# EAGLE design box-din4-lcd (EAGLE 5.11)
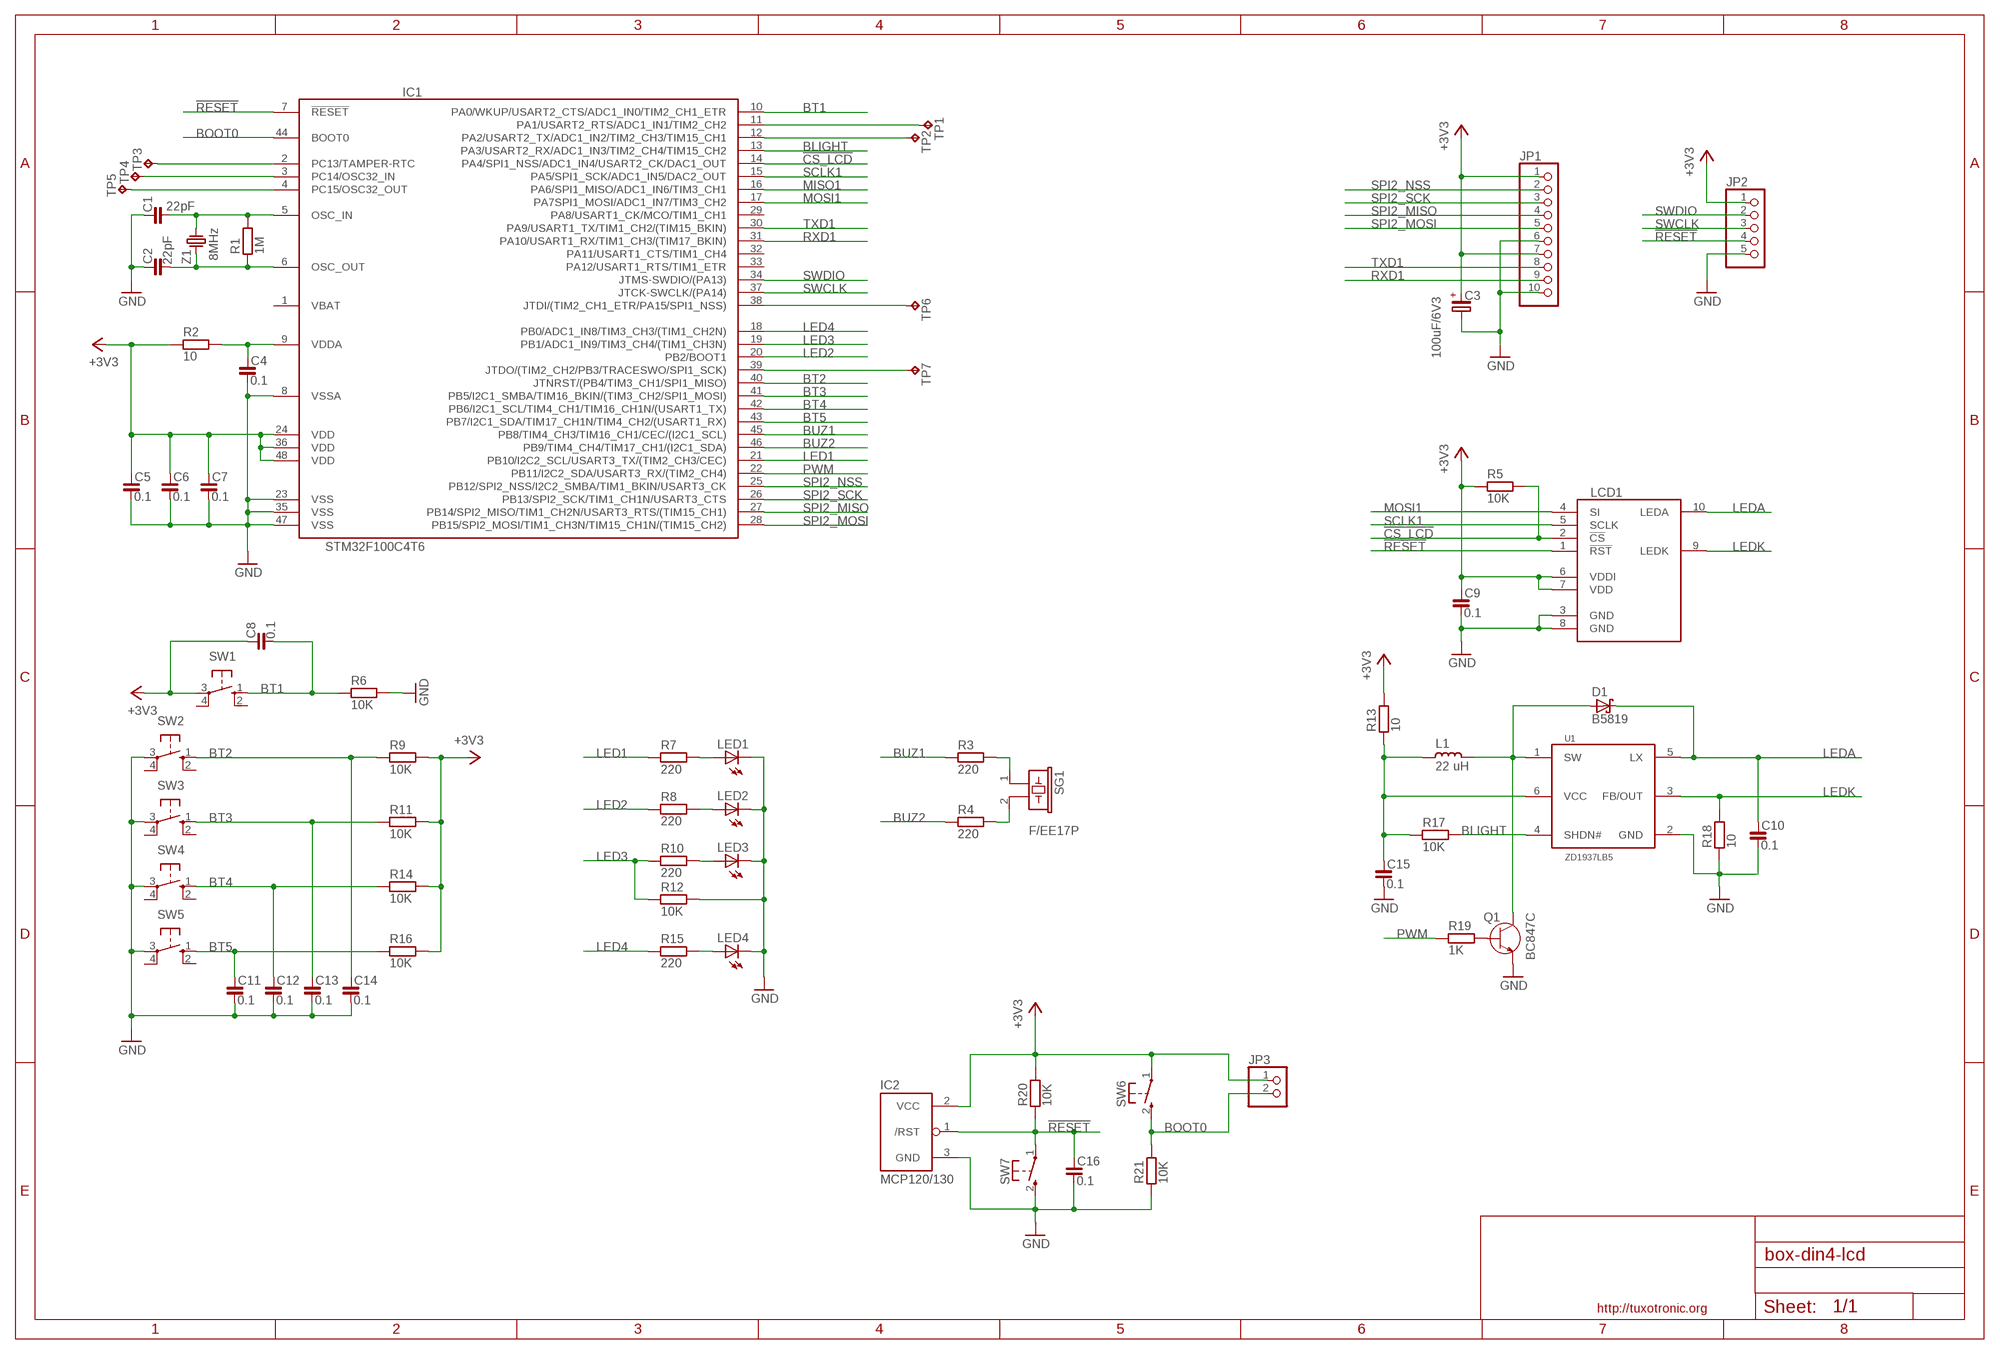
[diagram p0: schematic, sheet 1]

## Parts
C1  22pF  C_0603  [C0603]
C2  22pF  C_0603  [C0603]
C3  100uF/6V3  CP_SMCC  [SMC_C]
C4  0.1  C_0603  [C0603]
C5  0.1  C_0603  [C0603]
C6  0.1  C_0603  [C0603]
C7  0.1  C_0603  [C0603]
C8  0.1  C_0603  [C0603]
C9  0.1  C_0603  [C0603]
C10  0.1  C_0603  [C0603]
C11  0.1  C_0603  [C0603]
C12  0.1  C_0603  [C0603]
C13  0.1  C_0603  [C0603]
C14  0.1  C_0603  [C0603]
C15  0.1  C_0603  [C0603]
C16  0.1  C_0603  [C0603]
D1  B5819  SCHOTTKY-SOD123  [SOD123]
IC1  STM32F100C4T6  [LQFP48]
IC2  MCP120/130  [SOT23]
JP1  PINHD-1X10_2.00  [1X10M]
JP2  PINHD-1X5_2.00  [1X05M]
JP3  PINHD-1X2_2.00  [1X02M]
L1  22 uH  L_0805  [L0805]
LCD1  NOKIA_LCD_1616  [NOKIA1616LCD]
LED1  LEDCHIPLED_0805  [CHIPLED_0805]
LED2  LEDCHIPLED_0805  [CHIPLED_0805]
LED3  LEDCHIPLED_0805  [CHIPLED_0805]
LED4  LEDCHIPLED_0805  [CHIPLED_0805]
Q1  BC847C  [SOT23]
R1  1M  R_0603  [R0603]
R2  10  R_0603  [R0603]
R3  220  R_0603  [R0603]
R4  220  R_0603  [R0603]
R5  10K  R_0603  [R0603]
R6  10K  R_0603  [R0603]
R7  220  R_0603  [R0603]
R8  220  R_0603  [R0603]
R9  10K  R_0603  [R0603]
R10  220  R_0603  [R0603]
R11  10K  R_0603  [R0603]
R12  10K  R_0603  [R0603]
R13  10  R_0603  [R0603]
R14  10K  R_0603  [R0603]
R15  220  R_0603  [R0603]
R16  10K  R_0603  [R0603]
R17  10K  R_0603  [R0603]
R18  10  R_0603  [R0603]
R19  1K  R_0603  [R0603]
R20  10K  R_0603  [R0603]
R21  10K  R_0603  [R0603]
SG1  F/EE17P  [F/EE17P]
SW1  10-XX  [B3F-10XX]
SW2  10-XX  [B3F-10XX]
SW3  10-XX  [B3F-10XX]
SW4  10-XX  [B3F-10XX]
SW5  10-XX  [B3F-10XX]
SW6  KSS-2EG4430  [KSS-2EG4430]
SW7  KSS-2EG4430  [KSS-2EG4430]
TP1  TPB1,27  [B1,27]
TP2  TPB1,27  [B1,27]
TP3  TPB1,27  [B1,27]
TP4  TPB1,27  [B1,27]
TP5  TPB1,27  [B1,27]
TP6  TPB1,27  [B1,27]
TP7  TPB1,27  [B1,27]
U1  ZD1937LB5  [SOT23-6]
Z1  8MHz  CRYSTAL-HC49S  [HC49/S]

## Nets
!CS_LCD: IC1.14(PA4/SPI1_NSS/ADC1_IN4/USART2_CK/DAC1_OUT) LCD1.2(!CS) R5.2
!RESET: C16.1 IC1.7(!RESET) IC2.1(/RST) JP2.4 LCD1.1(!RST) R20.1 SW7.1(P)
+3V3: C3.+ C5.1 C6.1 C7.1 C8.1 C9.1 IC1.24(VDD) IC1.36(VDD) IC1.48(VDD) IC2.2(VCC) JP1.1 JP1.7 JP2.1 JP3.1 LCD1.6(VDDI) LCD1.7(VDD) R2.1 R5.1 R9.2 R11.2 R13.2 R14.2 R16.2 R20.2 SW1.3(P) SW6.1(P)
BLIGHT: IC1.13(PA3/USART2_RX/ADC1_IN3/TIM2_CH4/TIM15_CH2) R17.2 U1.4(SHDN#)
BOOT0: IC1.44(BOOT0) JP3.2 R21.2 SW6.2(S)
BT1: C8.2 IC1.10(PA0/WKUP/USART2_CTS/ADC1_IN0/TIM2_CH1_ETR) R6.1 SW1.1(S)
BT2: C14.1 IC1.40(JTNRST/(PB4/TIM3_CH1/SPI1_MISO)) R9.1 SW2.1(S)
BT3: C13.1 IC1.41(PB5/I2C1_SMBA/TIM16_BKIN/(TIM3_CH2/SPI1_MOSI)) R11.1 SW3.1(S)
BT4: C12.1 IC1.42(PB6/I2C1_SCL/TIM4_CH1/TIM16_CH1N/(USART1_TX)) R14.1 SW4.1(S)
BT5: C11.1 IC1.43(PB7/I2C1_SDA/TIM17_CH1N/TIM4_CH2/(USART1_RX)) R16.1 SW5.1(S)
BUZ1: IC1.45(PB8/TIM4_CH3/TIM16_CH1/CEC/(I2C1_SCL)) R3.1
BUZ2: IC1.46(PB9/TIM4_CH4/TIM17_CH1/(I2C1_SDA)) R4.1
GND: C1.1 C2.1 C3.- C4.2 C5.2 C6.2 C7.2 C9.2 C10.2 C11.2 C12.2 C13.2 C14.2 C15.2 C16.2 IC1.8(VSSA) IC1.23(VSS) IC1.35(VSS) IC1.47(VSS) IC2.3(GND) JP1.6 JP1.10 JP2.5 LCD1.3(GND) LCD1.8(GND) LED1.C LED2.C LED3.C LED4.C Q1.2(E) R6.2 R12.2 R18.1 R21.1 SW2.3(P) SW3.3(P) SW4.3(P) SW5.3(P) SW7.2(S) U1.2(GND)
LED1: IC1.21(PB10/I2C2_SCL/USART3_TX/(TIM2_CH3/CEC)) R7.1
LED2: IC1.20(PB2/BOOT1) R8.1
LED3: IC1.19(PB1/ADC1_IN9/TIM3_CH4/(TIM1_CH3N)) R10.1 R12.1
LED4: IC1.18(PB0/ADC1_IN8/TIM3_CH3/(TIM1_CH2N)) R15.1
LEDA: C10.1 D1.C LCD1.10(LEDA) U1.5(LX)
LEDK: LCD1.9(LEDK) R18.2 U1.3(FB/OUT)
MISO1: IC1.16(PA6/SPI1_MISO/ADC1_IN6/TIM3_CH1)
MOSI1: IC1.17(PA7SPI1_MOSI/ADC1_IN7/TIM3_CH2) LCD1.4(SI)
N$1: LED1.A R7.2
N$2: LED2.A R8.2
N$3: LED3.A R10.2
N$4: LED4.A R15.2
N$5: R4.2 SG1.2
N$6: D1.A L1.1 Q1.3(C) U1.1(SW)
N$7: C4.1 IC1.9(VDDA) R2.2
N$8: R3.2 SG1.1
N$9: IC1.39(JTDO/(TIM2_CH2/PB3/TRACESWO/SPI1_SCK)) TP7.PP(TP)
N$10: IC1.11(PA1/USART2_RTS/ADC1_IN1/TIM2_CH2) TP1.PP(TP)
N$11: IC1.12(PA2/USART2_TX/ADC1_IN2/TIM2_CH3/TIM15_CH1) TP2.PP(TP)
N$16: C1.2 IC1.5(OSC_IN) R1.2 Z1.2
N$17: IC1.2(PC13/TAMPER-RTC) TP3.PP(TP)
N$18: IC1.3(PC14/OSC32_IN) TP4.PP(TP)
N$19: IC1.4(PC15/OSC32_OUT) TP5.PP(TP)
N$20: IC1.38(JTDI/(TIM2_CH1_ETR/PA15/SPI1_NSS)) TP6.PP(TP)
N$21: C15.1 L1.2 R13.1 R17.1 U1.6(VCC)
N$22: Q1.1(B) R19.2
PWM: IC1.22(PB11/I2C2_SDA/USART3_RX/(TIM2_CH4)) R19.1
RXD1: IC1.31(PA10/USART1_RX/TIM1_CH3/(TIM17_BKIN)) JP1.9
SCLK1: IC1.15(PA5/SPI1_SCK/ADC1_IN5/DAC2_OUT) LCD1.5(SCLK)
SPI2_MISO: IC1.27(PB14/SPI2_MISO/TIM1_CH2N/USART3_RTS/(TIM15_CH1)) JP1.4
SPI2_MOSI: IC1.28(PB15/SPI2_MOSI/TIM1_CH3N/TIM15_CH1N/(TIM15_CH2)) JP1.5
SPI2_NSS: IC1.25(PB12/SPI2_NSS/I2C2_SMBA/TIM1_BKIN/USART3_CK) JP1.2
SPI2_SCK: IC1.26(PB13/SPI2_SCK/TIM1_CH1N/USART3_CTS) JP1.3
SWCLK: IC1.37(JTCK-SWCLK/(PA14)) JP2.3
SWDIO: IC1.34(JTMS-SWDIO/(PA13)) JP2.2
TXD1: IC1.30(PA9/USART1_TX/TIM1_CH2/(TIM15_BKIN)) JP1.8
XTAL2: C2.2 IC1.6(OSC_OUT) R1.1 Z1.1
Unconnected: IC1.29(PA8/USART1_CK/MCO/TIM1_CH1) IC1.32(PA11/USART1_CTS/TIM1_CH4) IC1.33(PA12/USART1_RTS/TIM1_ETR) SW1.2(S1) SW1.4(P1) SW2.2(S1) SW2.4(P1) SW3.2(S1) SW3.4(P1) SW4.2(S1) SW4.4(P1) SW5.2(S1) SW5.4(P1)

## Power pins joined to a net without a drawn wire
VBAT: IC1.1(VBAT)

## Library data of the parts
C1 C2 C4-C16 = rc-master-smd:C_: NON-POLARIZED CAP
C3 = rc-master-smd:CP_: POLARIZED CAP
D1 = discrete:SCHOTTKY-: Schottky Diode
IC1 = stm32:STM32F100C: Medium-density performance line ARM-based 32-bit MCU with 64 or 128 KB Flash, USB, CAN, 7 timers, 2 ADCs, 9 communication interfaces
IC2 = mcp120-130:MCP120/130
JP1 = pinhead-fixdrills:PINHD-1X10: PIN HEADER
JP2 = pinhead-fixdrills:PINHD-1X5: PIN HEADER
JP3 = pinhead-fixdrills:PINHD-1X2: PIN HEADER
L1 = rc-master-smd:L_: INDUCTOR
LCD1 = nokia_lcd:NOKIA_LCD: 1.3" b/w graphics display 96x68 pixel. From Nokia 1202 cell phone 1.8" color graphics display 128x160 pixel. From Nokia 1616 cell phone
LED1-LED4 = led:LED: LED OSRAM: - CHIPLED LG R971, LG N971, LY N971, LG Q971, LY Q971, LO R971, LY R971 LH N974, LH R974 LS Q976, LO Q976, LY Q976 LO Q996 - Hyper CHIPLED LW Q18S LB Q993, LB Q99A, LB R99A - SideLED LS A670, LO A670, LY A670, LG A670, LP A670 LB A673, LV A673, LT A673, LW A673 LH A674 LY A675 LS A676, LA A676, LO A676, LY A676, LW A676 LS A679, LY A679, LG A679 - Hyper Micro SIDELED® LS Y876, LA Y876, LO Y876, LY Y876 LT Y87S - SmartLED LW L88C, LW L88S LB L89C, LB L89S, LG L890 LS L89K, LO L89K, LY L89K LS L896, LA L896, LO L896, LY L896 - TOPLED LS T670, LO T670, LY T670, LG T670, LP T670 LSG T670, LSP T670, LSY T670, LOP T670, LYG T670 LG T671, LOG T671, LSG T671 LB T673, LV T673, LT T673, LW T673 LH T674 LS T676, LA T676, LO T676, LY T676, LB T676, LH T676, LSB T676, LW T676 LB T67C, LV T67C, LT T67C, LS T67K, LO T67K, LY T67K, LW E67C LS E67B, LA E67B, LO E67B, LY E67B, LB E67C, LV E67C, LT E67C LW T67C LS T679, LY T679, LG T679 LS T770, LO T770, LY T770, LG T770, LP T770 LB T773, LV T773, LT T773, LW T773 LH T774 LS E675, LA E675, LY E675, LS T675 LS T776, LA T776, LO T776, LY T776, LB T776 LHGB T686 LT T68C, LB T68C - Hyper Mini TOPLED® LB M676 - Mini TOPLED Santana® LG M470 LS M47K, LO M47K, LY M47K Source: http://www.osram.convergy.de - LUMILED® LXK2-PW12-R00, LXK2-PW12-S00, LXK2-PW14-U00, LXK2-PW14-V00 LXK2-PM12-R00, LXK2-PM12-S00, LXK2-PM14-U00 LXK2-PE12-Q00, LXK2-PE12-R00, LXK2-PE12-S00, LXK2-PE14-T00, LXK2-PE14-U00 LXK2-PB12-K00, LXK2-PB12-L00, LXK2-PB12-M00, LXK2-PB14-N00, LXK2-PB14-P00, LXK2-PB14-Q00 LXK2-PR12-L00, LXK2-PR12-M00, LXK2-PR14-Q00, LXK2-PR14-R00 LXK2-PD12-Q00, LXK2-PD12-R00, LXK2-PD12-S00 LXK2-PH12-R00, LXK2-PH12-S00 LXK2-PL12-P00, LXK2-PL12-Q00, LXK2-PL12-R00 Source: www.luxeon.com
Q1 = semiconductor:BC847: Bipolar transistor NPN-structure
R1-R21 = rc-master-smd:R_: RESISTOR
SG1 = buzzer:F/EE17P: BUZZER Source: Buerklin; OC_FARNELL: unknown; OC_NEWARK: unknown
SW1-SW5 = buttons:10-XX: OMRON SWITCH
SW6 SW7 = buttons:KSS-2EG4430: Size: 3x6mm Height: 5mm from PCB Rating: DC12v 50mA Travel: 0.25±0.10mm Operating Force: 180±50gf Return Force: 60gf min Contact resistance: 100m? max Insulation resistance: 100M? min Operating life?50,000 cycles
TP1-TP7 = testpad:TP: Test pad
U1 = vreg-pulse:ZD1937
Z1 = discrete:CRYSTAL-: CRYSTAL

## Board
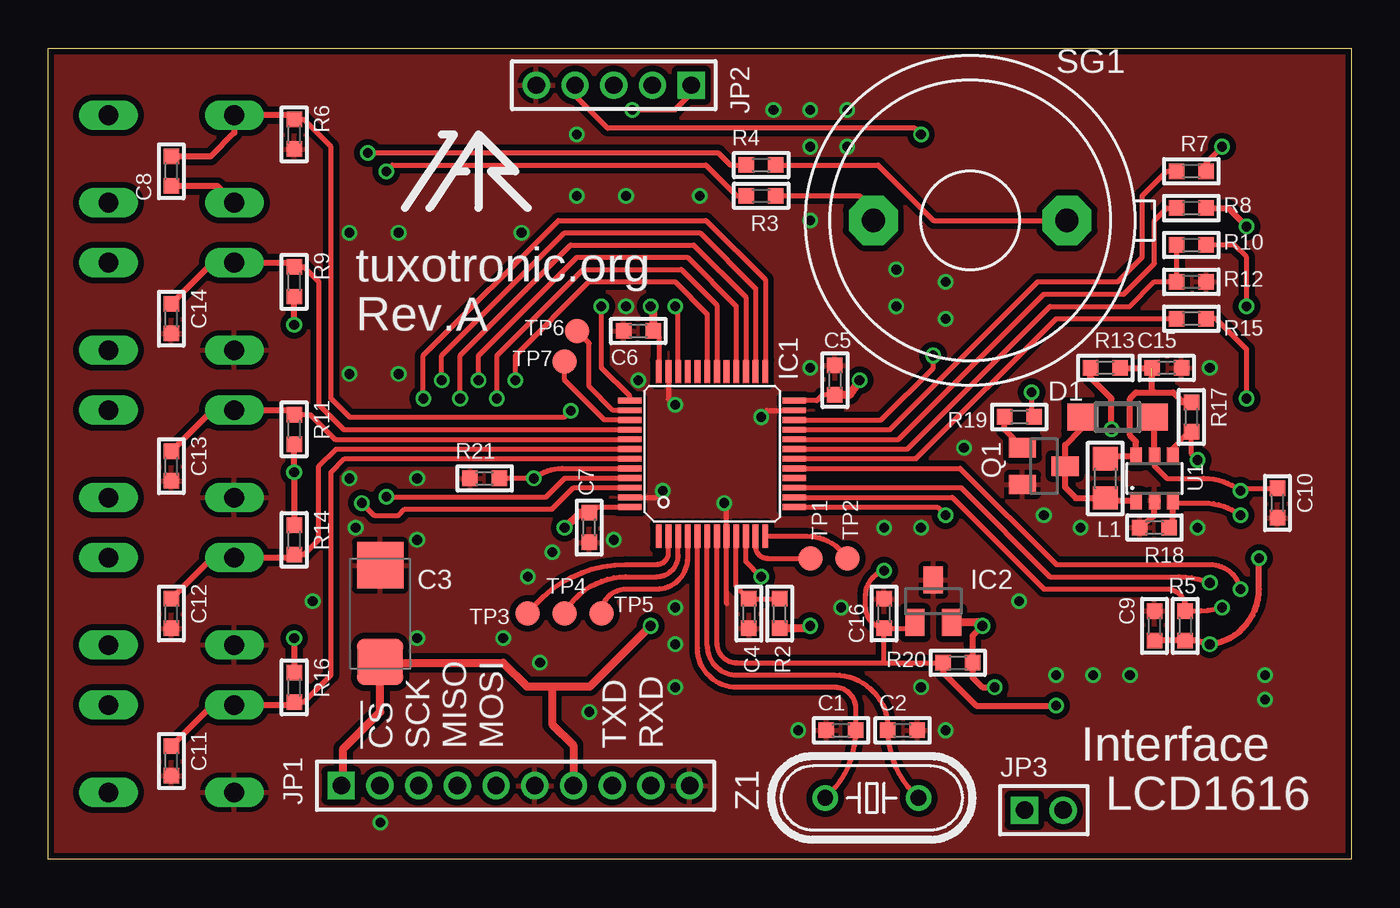
[diagram p1: board, top side]
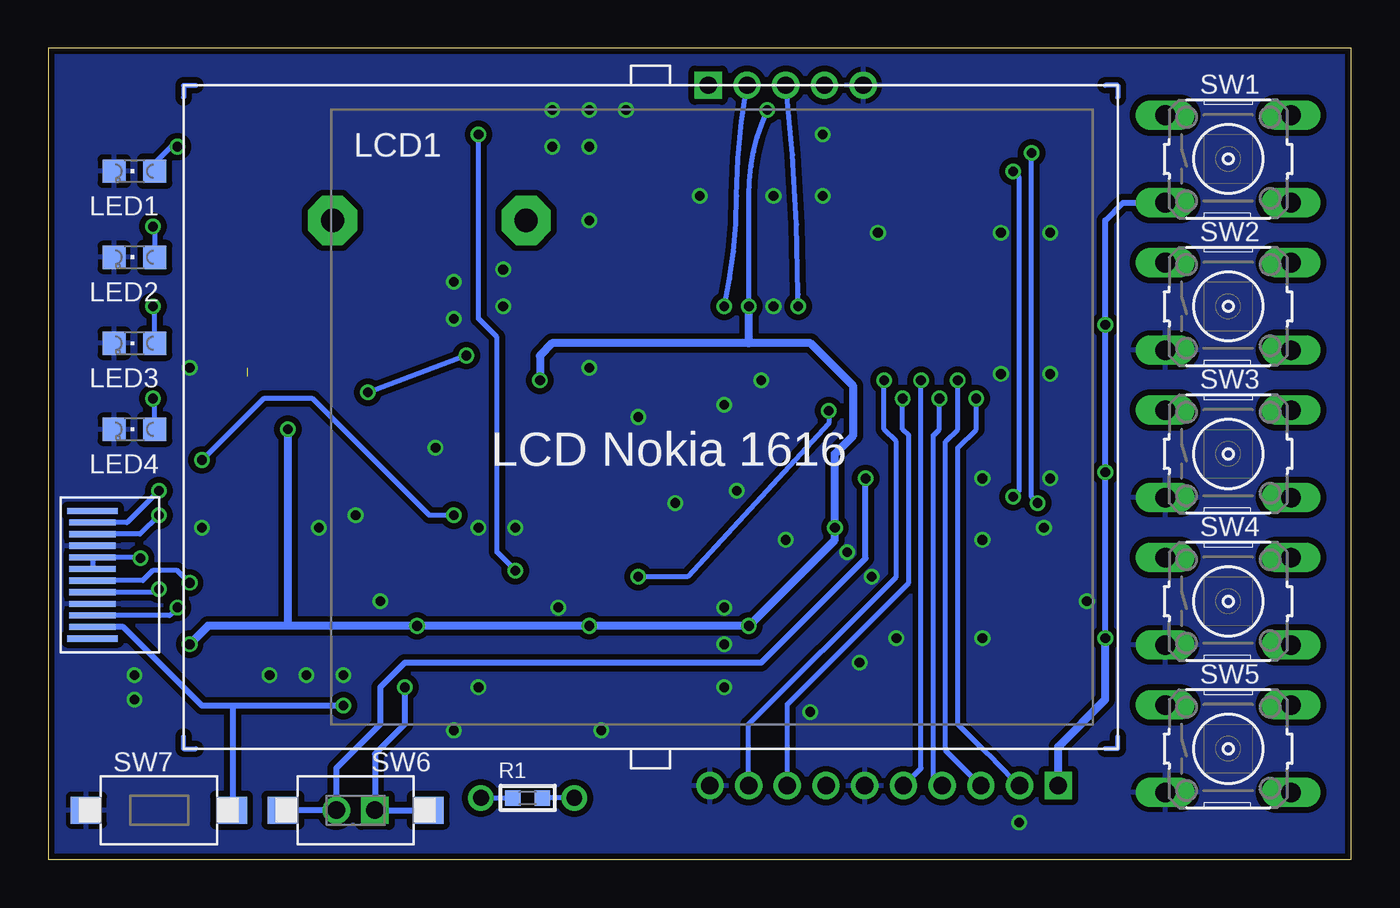
[diagram p2: board, bottom side, seen from below]

Size 67.31 x 41.91 mm. Coordinates in mm from the lower left corner, seen from the top.
Outline: 67.31,0 0,0 0,41.91 67.31,41.91 67.31,0
Copper layers (1*16): Top 0.035mm / dielectric 1.5mm / Bottom 0.035mm
Design rules "ITead_rule *": minimum track width 6mil, minimum drill 12mil, track to track 6mil, track to pad 6mil, pad to pad 6mil, via to via 6mil, smd to smd 0mil, copper to edge 10mil, drill to drill 10mil, minimum pad ring 10mil, minimum via ring 6mil, stop-mask expansion 2mil, vias tented up to drill 0.6mm, thermal gap 10mil

### Footprints (pad centres in the part's own frame; a part is rotated, then mirrored left to right if it is on the bottom)
C0603 = smd 0.8 x 0.8: 1 -0.762,0; 2 0.762,0
SMC_C = smd 2.4 x 2.4: + -2.5,0; - 2.5,0
SOD123 = smd 1.4 x 1.4: A 1.9,0; C -1.9,0
LQFP48 = smd 0.3 x 1.2: 1 -2.75,-4.25; 2 -2.25,-4.25; 3 -1.75,-4.25; 4 -1.25,-4.25; 5 -0.75,-4.25; 6 -0.25,-4.25; 7 0.25,-4.25; 8 0.75,-4.25; 9 1.25,-4.25; 10 1.75,-4.25; 11 2.25,-4.25; 12 2.75,-4.25; 25 2.75,4.25; 26 2.25,4.25; 27 1.75,4.25; 28 1.25,4.25; 29 0.75,4.25; 30 0.25,4.25; 31 -0.25,4.25; 32 -0.75,4.25; 33 -1.25,4.25; 34 -1.75,4.25; 35 -2.25,4.25; 36 -2.75,4.25 | smd 1.2 x 0.3: 13 4.25,-2.75; 14 4.25,-2.25; 15 4.25,-1.75; 16 4.25,-1.25; 17 4.25,-0.75; 18 4.25,-0.25; 19 4.25,0.25; 20 4.25,0.75; 21 4.25,1.25; 22 4.25,1.75; 23 4.25,2.25; 24 4.25,2.75; 37 -4.25,2.75; 38 -4.25,2.25; 39 -4.25,1.75; 40 -4.25,1.25; 41 -4.25,0.75; 42 -4.25,0.25; 43 -4.25,-0.25; 44 -4.25,-0.75; 45 -4.25,-1.25; 46 -4.25,-1.75; 47 -4.25,-2.25; 48 -4.25,-2.75
SOT23 = smd 1 x 1.4: 1 -0.95,-1.1; 2 0.95,-1.1; 3 0,1.1
1X10M = drill 0.9 square: 1 -9,0 | drill 0.9 round: 2 -7,0; 3 -5,0; 4 -3,0; 5 -1,0; 6 1,0; 7 3,0; 8 5,0; 9 7,0; 10 9,0
1X05M = drill 0.9 square: 1 -4,0 | drill 0.9 round: 2 -2,0; 3 0,0; 4 2,0; 5 4,0
1X02M = drill 0.9 square: 1 -1,0 | drill 0.9 round: 2 1,0
L0805 = smd 1.2 x 1.3: 1 -1.016,0; 2 1.016,0
NOKIA1616LCD = smd 0.32 x 2.6: 0 -11.455,28.829; 11 -4.855,28.829 | smd 0.32 x 2.4: 1 -10.855,28.829; 2 -10.255,28.829; 3 -9.655,28.829; 4 -9.055,28.829; 5 -8.455,28.829; 6 -7.855,28.829; 7 -7.255,28.829; 8 -6.655,28.829; 9 -6.055,28.829; 10 -5.455,28.829
CHIPLED_0805 = smd 1.2 x 1.2: A 0,-1.05; C 0,1.05
R0603 = smd 0.8 x 0.8: 1 -0.762,0; 2 0.762,0
F/EE17P = drill 1.194 pad 2.54 octagon: 1 -5.004,0; 2 5.004,0
B3F-10XX = drill 1.016 long: 1 -3.251,2.261; 2 3.251,2.261; 3 -3.251,-2.261; 4 3.251,-2.261
KSS-2EG4430 = smd 1.6 x 1.4: 1 -3.75,0; 2 3.75,0
B1,27 = smd 1.27 x 1.27: PP 0,0
SOT23-6 = smd 0.6 x 0.9: 1 -0.95,-1.15; 2 0,-1.15; 3 0.95,-1.15; 4 0.95,1.15; 5 0,1.15; 6 -0.95,1.15
HC49/S = drill 0.813 round: 1 -2.413,0; 2 2.413,0

### Placement (x,y rotation side)
C1  40.96,6.67 0 top
C2  44.13,6.67 180 top
C3  17.14,12.7 90 top
C4  36.2,12.7 270 top
C5  40.64,24.77 90 top
C6  30.48,27.3 180 top
C7  27.94,17.14 270 top
C8  6.35,35.56 90 top
C9  57.15,12.06 90 top
C10  63.5,18.41 270 top
C11  6.35,5.08 270 top
C12  6.35,12.7 270 top
C13  6.35,20.32 270 top
C14  6.35,27.94 270 top
C15  57.78,25.4 0 top
C16  43.18,12.7 90 top
D1  55.24,22.86 180 top
IC1  34.29,20.95 0 top
IC2  45.72,13.34 0 top
JP1  24.13,3.81 0 top
JP2  29.21,40.01 180 top
JP3  51.44,2.54 0 top
L1  54.61,19.68 90 top
LCD1  36.2,22.86 90 bottom
LED1  62.87,35.56 90 bottom
LED2  62.87,31.11 90 bottom
LED3  62.87,26.67 90 bottom
LED4  62.87,22.23 90 bottom
Q1  51.44,20.32 270 top
R1  42.55,3.17 0 bottom
R2  37.78,12.7 90 top
R3  36.83,34.29 0 top
R4  36.83,35.88 0 top
R5  58.74,12.06 90 top
R6  12.7,37.47 270 top
R7  59.05,35.56 0 top
R8  59.05,33.66 0 top
R9  12.7,29.84 270 top
R10  59.05,31.75 0 top
R11  12.7,22.23 270 top
R12  59.05,29.84 0 top
R13  54.61,25.4 180 top
R14  12.7,16.51 90 top
R15  59.05,27.94 0 top
R16  12.7,8.89 90 top
R17  59.05,22.86 270 top
R18  57.15,17.14 0 top
R19  50.16,22.86 180 top
R20  46.99,10.16 0 top
R21  22.54,19.68 0 top
SG1  47.62,33.02 0 top
SW1  6.35,36.2 0 bottom
SW2  6.35,28.57 0 bottom
SW3  6.35,20.95 0 bottom
SW4  6.35,13.34 0 bottom
SW5  6.35,5.71 0 bottom
SW6  51.44,2.54 180 bottom
SW7  61.59,2.54 180 bottom
TP1  39.37,15.56 0 top
TP2  41.27,15.56 0 top
TP3  24.77,12.7 180 top
TP4  26.67,12.7 180 top
TP5  28.57,12.7 180 top
TP6  27.3,27.3 0 top
TP7  26.67,25.72 90 top
U1  57.15,19.68 0 top
Z1  42.55,3.17 180 top

### Tracks (layer width: path | path; a pad name or v marks a point on that pad's centre or on a via)
!CS_LCD  (via drill 0.5)
  Top 0.254: IC1.14 46.7,18.7 51.44,13.97 57.78,13.97 arc-100 R5.2 59.18,12.83 arc15 v60.64,13.02
  Bottom 0.254: LCD1.2 61.05,12.61 v60.64,13.02
!RESET  (via drill 0.5)
  Top 0.254: 43.18,10.16 35.56,10.16 arc-90 34.54,11.18 IC1.7 | 43.18,10.16 R20.1 | 43.18,10.16 C16.1 | C16.1 44.47,11.94 IC2.1 | JP2.4 27.21,39.47 28.89,37.78 44.77,37.78 v45.09,37.47 | v43.18,14.92 arc74 42.23,13.65 42.23,13.02 arc83 C16.1
  Top 0.305: R20.1 46.23,9.65 47.94,7.94 v52.07,7.94
  Bottom 0.254: v45.09,37.47 45.09,27.94 44.13,26.99 44.13,15.88 v43.18,14.92
  Bottom 0.305: LCD1.1 63.44,12.01 59.37,7.94 57.78,7.94 | SW7.1 57.78,2.6 57.78,7.94 | v52.07,7.94 57.78,7.94
+3V3  (via drill 0.5)
  Top 0.254: IC1.36 31.54,27.01 C6.1 | IC1.24 39.71,23.7 40.01,24 C5.1 | IC1.48 28.36,18.2 27.94,17.78 C7.1 | IC2.2 46.48,12.05 | JP2.1 33.21,39.56 32.38,38.73 v30.16,38.73
  Top 0.305: v12.7,11.43 R16.2 | v12.7,27.62 R9.2 | R11.2 v12.7,20 R14.2 | C9.1 R5.1 59.24,11.3 v60.01,11.11 arc83 62.55,13.97 v62.55,15.56 | v48.26,12.06 47.75,11.56 R20.2 47.75,9.4 48.26,8.89 v48.9,8.89 | v54.93,22.23 54.93,23.81 53.85,24.89 R13.2 | C8.1 8.74,34.8 SW1.3
  Top 0.406: IC2.2 48.09,12.23 v48.26,12.06 | C7.1 27.5,17.91 v26.67,17.14 | C6.1 31.24,28.45 v31.11,28.57 | C5.1 41.4,24 v41.91,24.77 | R2.1 39.18,11.94 v39.37,12.06 | JP1.1 15.24,3.92 15.24,5.71 17.14,7.62 C3.+ 17.18,10.16 23.5,10.16 24.73,8.93 26.04,8.93 | v31.11,12.06 27.98,8.93 26.04,8.93 | JP1.7 27.13,5.89 26.04,6.99 26.04,8.93
  Bottom 0.254: LCD1.6 LCD1.7 62.59,15.61 v62.55,15.56 | v31.11,28.57 31.11,34.29 arc24 v30.16,38.73
  Bottom 0.305: v12.7,11.43 v12.7,20 v12.7,27.62 12.7,33.02 11.79,33.93 SW1.3 | SW6.1 JP3.1 50.44,5.45 48.9,6.99 v48.9,8.89
  Bottom 0.406: 31.11,26.67 27.94,26.67 25.72,24.45 25.72,21.91 26.67,20.95 v26.67,17.14 26.67,16.51 v31.11,12.06 v39.37,12.06 v48.26,12.06 54.93,12.06 | v41.91,24.77 41.91,26.04 41.27,26.67 31.11,26.67 | 31.11,26.67 v31.11,28.57 | 54.93,12.06 v54.93,22.23 | 54.93,12.06 59.05,12.06 v60.01,11.11 | JP1.1 15.13,5.83 12.7,8.26 v12.7,11.43
BLIGHT  (via drill 0.5)
  Top 0.254: U1.4 58.1,21.27 58.93,22.1 R17.2 59.05,20.95 v59.37,20.64 | IC1.13 45.93,18.2 v46.35,17.78
  Bottom 0.254: v46.35,17.78 47.62,17.78 53.66,23.81 56.2,23.81 v59.37,20.64
BOOT0  (via drill 0.5)
  Top 0.254: IC1.44 26.55,20.2 arc39 v25.08,19.68 R21.2
  Bottom 0.305: v25.08,19.68 25.08,15.56 30.48,10.16 48.9,10.16 50.16,8.89 50.16,6.99 52.44,4.71 JP3.2 SW6.2
BT1  (via drill 0.5)
  Top 0.254: R6.1 13.21,38.23 14.61,36.83 14.61,23.81 15.56,22.86 26.67,22.86 v26.99,23.18 | IC1.10 36.04,15.39 v36.83,14.61
  Top 0.305: R6.1 12.47,38.46 SW1.1 9.6,37.54 8.38,36.32 C8.2
  Bottom 0.254: v36.83,14.61 34.29,14.61 26.99,22.54 v26.99,23.18
BT2
  Top 0.254: IC1.40 15.26,22.2 13.97,23.5 13.97,29.84 13.21,30.61 R9.1
  Top 0.305: C14.1 8.48,30.84 SW2.1 12.47,30.84 R9.1
BT3
  Top 0.254: IC1.41 14.81,21.7 13.53,22.99 R11.1
  Top 0.305: C13.1 8.48,23.22 SW3.1 12.47,23.22 R11.1
BT4
  Top 0.254: IC1.42 14.86,21.2 13.97,20.32 13.97,16.51 13.21,15.75 R14.1
  Top 0.305: C12.1 8.48,15.6 SW4.1 12.55,15.6 R14.1
BT5
  Top 0.254: IC1.43 15.31,20.7 14.61,20 14.61,9.53 13.21,8.13 R16.1
  Top 0.305: R16.1 12.55,7.98 SW5.1 8.48,7.98 C11.1
BUZ1  (via drill 0.5)
  Top 0.254: IC1.45 26.69,19.7 25.72,18.73 v17.46,18.73 | v17.46,35.56 17.78,35.88 33.97,35.88 35.56,34.29 R3.1
  Bottom 0.254: v17.46,18.73 17.14,19.05 17.14,35.24 v17.46,35.56
BUZ2  (via drill 0.5)
  Top 0.254: IC1.46 27.14,19.2 26.04,18.1 18.41,18.1 18.1,17.78 16.83,17.78 v16.19,18.41 | R4.1 35.24,35.88 34.61,36.51 v16.51,36.51
  Bottom 0.254: v16.19,18.41 16.51,18.73 v16.51,36.51
GND  (via drill 0.5)
  Top 0.254: 35.04,13.22 IC1.8 35.04,18.3 | IC1.47 31.41,18.7 | 37.12,23.2 IC1.23 | IC1.35 32.04,23.79
  Top 0.305: U1.2 57.15,17.78 R18.1
  other vias: 30.48,24.77 29.21,16.51 39.37,25.4 40.96,13.02 18.1,25.08 15.56,25.08 15.56,19.68 19.05,19.68 25.4,10.16 23.5,11.43 19.05,11.43 19.05,16.51 27.3,34.29 33.66,34.29 29.84,34.29 29.84,28.57 15.88,17.14 15.56,32.38 18.1,32.38 43.18,17.14 45.09,17.14 32.38,8.89 32.38,13.02 17.14,1.91 38.73,6.67 45.09,8.89 52.07,9.53 53.98,9.53 55.88,9.53 50.16,13.34 60.01,25.4 59.37,17.14 43.81,30.48 43.81,28.57 46.35,27.94 46.35,29.84 27.3,37.47 37.47,38.73 39.37,38.73 41.27,38.73 47.31,21.27 51.44,17.78 53.34,17.14 62.87,9.53 62.87,8.26 27.94,7.62 32.38,23.5 31.75,19.05 34.92,18.41 36.83,22.86 39.37,36.83 41.27,36.83 39.37,33.02 46.35,6.67 26.04,15.88 24.77,14.61 24.45,32.38 32.38,11.11 13.65,13.34
  pour Bottom (isolate 0.305, rank 5): 67.94,42.55 -0.64,42.55 -0.64,-0.64 67.94,-0.64
  pour Top (isolate 0.305, rank 5): 67.94,42.55 -0.64,42.55 -0.64,-0.64 67.94,-0.64
LED1
  Top 0.254: IC1.21 43.48,22.2 51.12,29.84 55.24,29.84 56.52,31.11 56.52,34.29 57.78,35.56 R7.1
LED2
  Top 0.254: IC1.20 43.93,21.7 51.44,29.21 55.56,29.21 57.15,30.8 57.15,33.02 57.78,33.66 R8.1
LED3
  Top 0.254: R10.1 R12.1 57.15,29.84 55.88,28.57 51.75,28.57 44.38,21.2 IC1.19
LED4
  Top 0.254: IC1.18 44.84,20.7 52.07,27.94 R15.1
LEDA  (via drill 0.5)
  Top 0.254: U1.5 57.15,20.32 57.78,19.68 59.69,19.68 arc-37 v61.59,19.05 61.72,19.18 C10.1
  Top 0.305: D1.C U1.5
  Bottom 0.254: LCD1.10 63.24,17.41 v61.59,19.05
LEDK  (via drill 0.5)
  Top 0.254: U1.3 58.22,18.41 59.69,18.41 arc-37 v61.59,17.78
  Top 0.305: U1.3 58.1,17.33 R18.2
  Bottom 0.254: LCD1.9 62.57,16.8 v61.59,17.78
MOSI1  (via drill 0.5)
  Top 0.254: IC1.17 47.1,20.2 52.07,15.24 60.01,15.24 arc-77 v61.59,13.97
  Bottom 0.254: LCD1.4 61.76,13.8 v61.59,13.97
N$1  (via drill 0.5)
  Top 0.254: R7.2 59.82,36.01 v60.64,36.83
  Bottom 0.254: v60.64,36.83 60.96,36.83 61.81,35.98 LED1.A
N$2  (via drill 0.5)
  Top 0.305: v61.91,32.7 60.96,33.66 R8.2
  Bottom 0.254: LED2.A 61.81,32.6 v61.91,32.7
N$3  (via drill 0.5)
  Top 0.254: R10.2 61.28,31.75 61.91,31.11 v61.91,28.57
  Bottom 0.254: LED3.A 61.81,28.48 v61.91,28.57
N$4  (via drill 0.5)
  Top 0.254: v61.91,23.81 61.91,26.35 60.33,27.94 R15.2
  Top 0.305: R15.2 59.69,27.94
  Bottom 0.254: LED4.A 61.81,23.71 v61.91,23.81
N$5
  Top 0.254: R4.2 42.86,35.88 45.72,33.02 SG1.2
N$6
  Top 0.305: U1.1 54.74,18.54 L1.1 53.09,18.67 52.53,19.22 Q1.3 52.53,21.42 53.34,22.23 D1.A
N$7
  Top 0.254: R2.2 C4.1 35.54,14.12 IC1.9
N$8
  Top 0.254: R3.2 41.91,34.29 42.62,33.58 SG1.1
N$9
  Top 0.254: IC1.39 28.73,22.7 26.67,24.77 TP7.PP
N$10
  Top 0.254: IC1.11 36.54,16.16 arc90 37.15,15.56 TP1.PP
N$11
  Top 0.254: IC1.12 39.17,16.7 arc-57 TP2.PP
N$12
  Bottom 0.254: 12.7,40.01 12.06,40.01 12.06,39.37
N$13
  Bottom 0.254: 12.7,5.71 12.06,5.71 12.06,6.35
N$14
  Bottom 0.254: 59.69,5.71 60.33,5.71 60.33,6.35
N$15
  Bottom 0.254: 59.69,40.01 60.33,40.01 60.33,39.37
N$16
  Top 0.254: IC1.5 33.54,10.91 arc90 35.56,8.89 40.64,8.89 arc-90 41.72,7.81 C1.2 arc-49 Z1.2
  Bottom 0.254: Z1.2 R1.2
N$17
  Top 0.254: IC1.2 32.04,15.85 arc-90 31.43,15.24 29.84,15.24 arc53 TP3.PP
N$18
  Top 0.254: IC1.3 32.54,15.71 arc-90 31.43,14.61 29.84,14.61 arc62 TP4.PP
N$19
  Top 0.254: IC1.4 33.04,15.58 arc-90 31.43,13.97 29.84,13.97 arc90 TP5.PP
N$20
  Top 0.254: IC1.38 29.18,23.2 27.94,24.45 27.94,26.67 TP6.PP
N$21  (1 unrouted)
  Top 0.305: L1.2 54.74,20.84 U1.6 56.2,21.59 55.88,21.91 55.88,23.81 56.2,24.13 57.15,24.13 | R13.1 C15.1 | R17.1 58.61,23.62 58.1,24.13 57.15,24.13 | 57.02,24.96 57.02,24.26 57.15,24.13
N$22
  Top 0.305: R19.2 49.4,22.2 Q1.1
PWM  (via drill 0.5)
  Top 0.254: IC1.22 43.02,22.7 45.72,25.4 v45.72,26.04 | v50.8,24.13 50.8,22.99 R19.1
  Bottom 0.254: v45.72,26.04 v50.8,24.13
RXD1  (via drill 0.5)
  Top 0.254: IC1.31 34.04,28.19 32.38,29.84 27.94,29.84 24.13,26.04 v24.13,24.77
  Bottom 0.254: JP1.9 31.13,6.97 23.5,14.61 23.5,21.59 24.13,22.23 v24.13,24.77
SCLK1  (via drill 0.5)
  Top 0.254: IC1.15 47.15,19.2 51.75,14.61 58.42,14.61 arc-23 v60.01,14.29
  Bottom 0.254: LCD1.5 62.43,14.4 61.91,14.92 60.64,14.92 v60.01,14.29
SPI2_MISO  (via drill 0.5)
  Top 0.254: IC1.27 36.04,29.05 33.34,31.75 26.99,31.75 21.27,26.04 v21.27,23.81
  Bottom 0.254: v21.27,23.81 21.27,22.23 21.59,21.91 21.59,4.27 JP1.4
SPI2_MOSI  (via drill 0.5)
  Top 0.254: IC1.28 35.54,28.59 33.02,31.11 27.3,31.11 22.23,26.04 v22.23,24.77
  Bottom 0.254: v22.23,24.77 22.23,4.71 JP1.5
SPI2_NSS  (via drill 0.5)
  Top 0.254: IC1.25 37.04,29.95 33.97,33.02 26.35,33.02 19.37,26.04 v19.37,23.81
  Bottom 0.254: v19.37,23.81 19.37,22.23 20.32,21.27 20.32,6.99 19.05,5.71 18.4,5.08 JP1.2
SPI2_SCK  (via drill 0.5)
  Top 0.254: IC1.26 36.54,29.5 33.66,32.38 26.67,32.38 20.32,26.04 v20.32,24.77
  Bottom 0.254: v20.32,24.77 20.32,22.23 20.95,21.59 20.95,5.63 JP1.3
SWCLK  (via drill 0.5)
  Top 0.254: IC1.37 30.04,23.93 28.57,25.4 v28.57,28.57
  Bottom 0.254: v28.57,28.57 28.57,29.21 arc-7 JP2.3
SWDIO  (via drill 0.5)
  Top 0.254: IC1.34 32.54,28.41 v32.38,28.57
  Bottom 0.254: JP2.2 arc-11 31.75,34.29 arc13 v32.38,28.57
TXD1  (via drill 0.5)
  Top 0.254: IC1.30 34.54,28.64 32.7,30.48 27.62,30.48 23.18,26.04 v23.18,23.81
  Bottom 0.254: v23.18,23.81 23.18,22.23 22.86,21.91 22.86,14.29 29.13,8.02 JP1.8
XTAL2
  Top 0.254: Z1.1 arc-49 C2.2 43.37,6.79 arc90 40.64,9.53 35.56,9.53 arc-90 34.04,11.04 IC1.6
  Bottom 0.254: Z1.1 R1.1

### Text on the board
tNames: tuxotronic.org | Rev.A | !CS | SCK | MISO | MOSI | TXD | RXD | Interface | LCD1616
bNames: LCD Nokia 1616